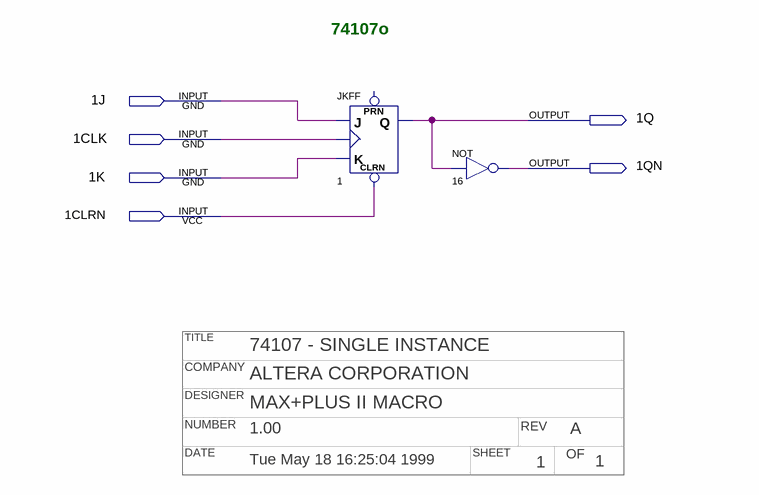
[diagram p0: schematic sheet]
// Quartus schematic 74107o.bdf as structural Verilog: 2 symbols, 6 pins
// Title block: TITLE: 74107 - SINGLE INSTANCE; COMPANY: ALTERA CORPORATION; DESIGNER: MAX+PLUS II MACRO; NUMBER: 1.00; REV: A; DATE: Tue May 18 16:25:04 1999; SHEET: 1; OF: 1
module \74107o  (
  input  \1J ,
  input  \1CLK ,
  input  \1K ,
  input  \1CLRN ,
  output \1Q ,
  output \1QN 
);

  JKFF u_1 (.CLRN(\1CLRN ), .K(\1K ), .J(\1J ), .CLK(\1CLK ), .Q(\1Q ));  // open: PRN
  not u_16 (\1QN , \1Q );

  // Notes on the sheet:
  //   74107o
endmodule
